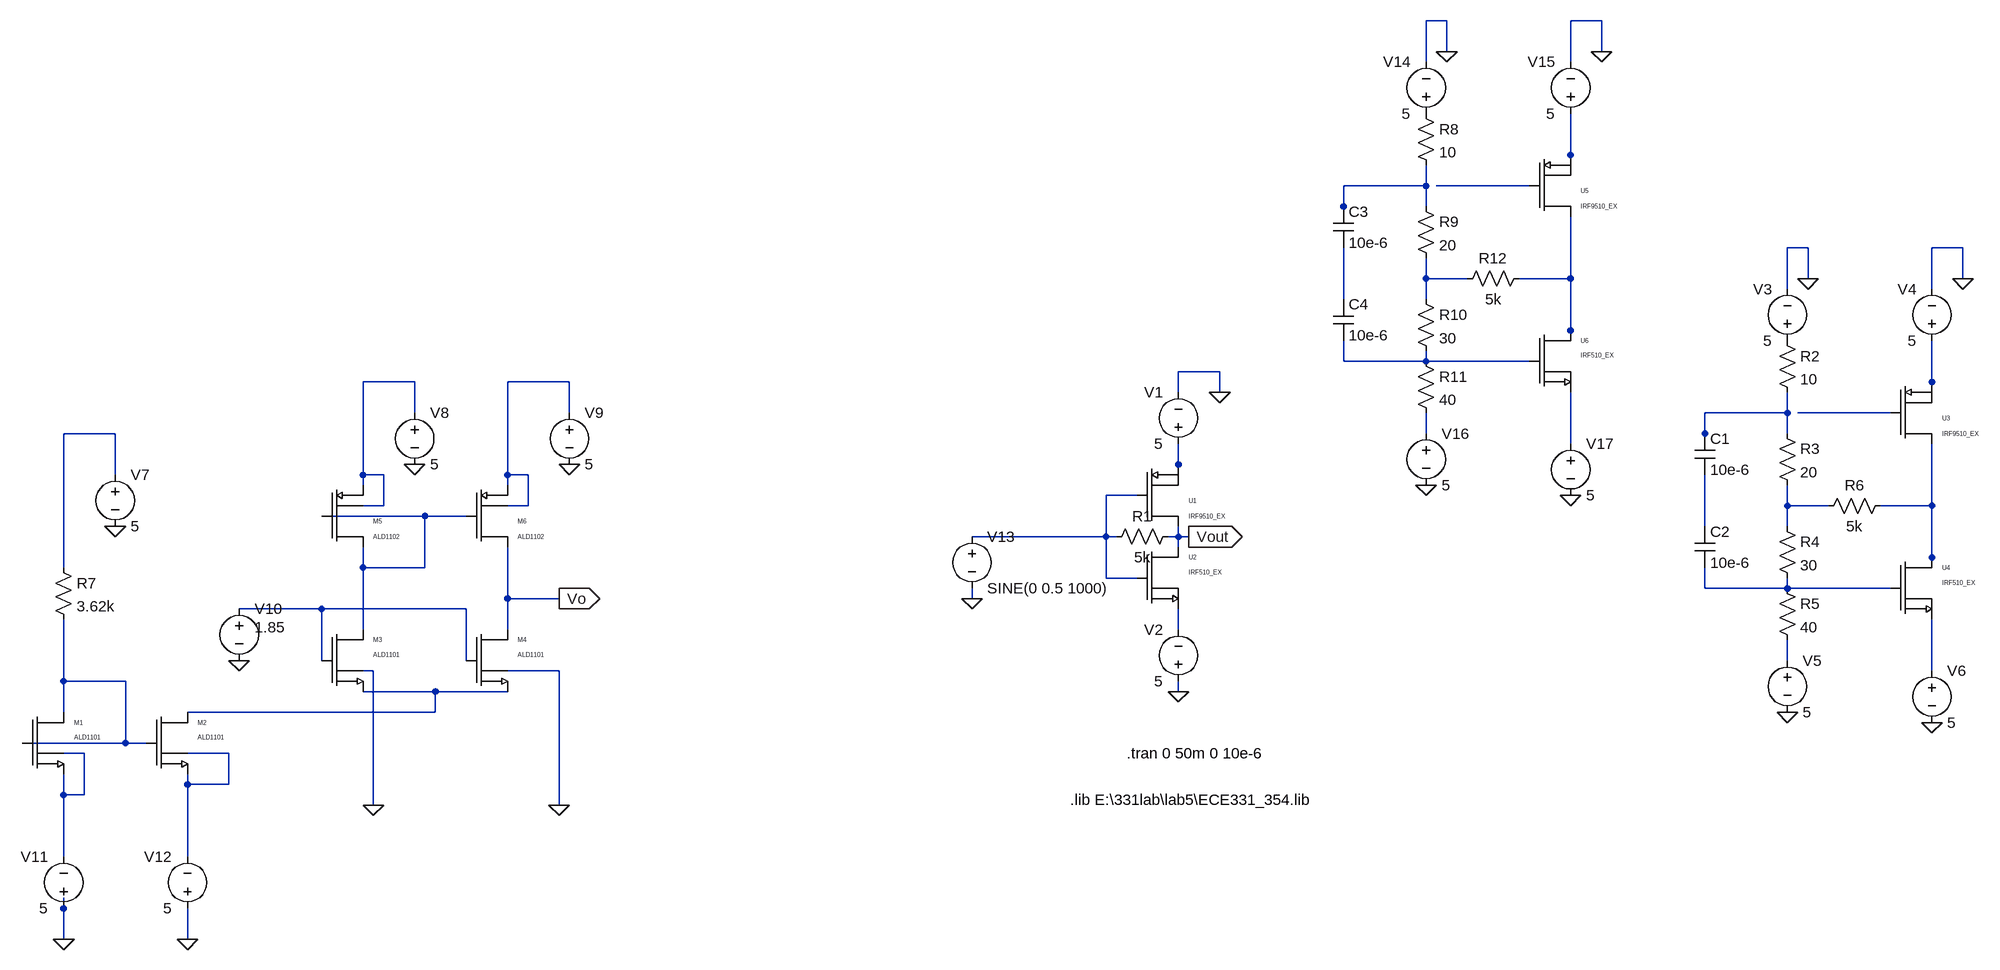
[diagram p0: schematic lab5_x.asc]
lab5_x.asc, the LTspice schematic file:
Version 4
SHEET 1 1404 932
WIRE 480 -512 448 -512
WIRE 720 -512 672 -512
WIRE 480 -464 480 -512
WIRE 720 -464 720 -512
WIRE 448 -448 448 -512
WIRE 672 -448 672 -512
WIRE 672 -304 672 -368
WIRE 672 -288 672 -304
WIRE 448 -256 448 -288
WIRE 448 -256 320 -256
WIRE 608 -256 464 -256
WIRE 320 -224 320 -256
WIRE 448 -224 448 -256
WIRE 320 -208 320 -224
WIRE 1040 -160 1008 -160
WIRE 1280 -160 1232 -160
WIRE 448 -112 448 -144
WIRE 512 -112 448 -112
WIRE 672 -112 672 -208
WIRE 672 -112 592 -112
WIRE 1040 -112 1040 -160
WIRE 1280 -112 1280 -160
WIRE 1008 -96 1008 -160
WIRE 1232 -96 1232 -160
WIRE 320 -80 320 -160
WIRE 448 -80 448 -112
WIRE 672 -32 672 -112
WIRE 672 -16 672 -32
WIRE 320 16 320 -16
WIRE 448 16 448 0
WIRE 448 16 320 16
WIRE 608 16 448 16
WIRE 128 32 64 32
WIRE -1120 48 -1200 48
WIRE -880 48 -976 48
WIRE 1232 48 1232 -16
WIRE 64 64 64 32
WIRE 128 64 128 32
WIRE 1232 64 1232 48
WIRE -1120 96 -1120 48
WIRE -880 96 -880 48
WIRE 1008 96 1008 64
WIRE 1008 96 880 96
WIRE 1168 96 1024 96
WIRE -1584 128 -1664 128
WIRE 448 128 448 96
WIRE 880 128 880 96
WIRE 1008 128 1008 96
WIRE 672 144 672 64
WIRE 880 144 880 128
WIRE 64 176 64 144
WIRE -1584 192 -1584 128
WIRE -1200 192 -1200 48
WIRE -1168 192 -1200 192
WIRE -976 192 -976 48
WIRE -944 192 -976 192
WIRE 64 192 64 176
WIRE -1200 208 -1200 192
WIRE -976 208 -976 192
WIRE 0 224 -48 224
WIRE -1168 240 -1168 192
WIRE -1168 240 -1200 240
WIRE -944 240 -944 192
WIRE -944 240 -976 240
WIRE 1008 240 1008 208
WIRE 1072 240 1008 240
WIRE 1232 240 1232 144
WIRE 1232 240 1152 240
WIRE -1104 256 -1264 256
WIRE -1040 256 -1104 256
WIRE 880 272 880 192
WIRE 1008 272 1008 240
WIRE -48 288 -48 224
WIRE -48 288 -256 288
WIRE -32 288 -48 288
WIRE 64 288 64 272
WIRE 64 288 48 288
WIRE 80 288 64 288
WIRE 64 304 64 288
WIRE 1232 320 1232 240
WIRE -1664 336 -1664 128
WIRE -1200 336 -1200 304
WIRE -1104 336 -1104 256
WIRE -1104 336 -1200 336
WIRE 1232 336 1232 320
WIRE -48 352 -48 288
WIRE 0 352 -48 352
WIRE 880 368 880 336
WIRE 1008 368 1008 352
WIRE 1008 368 880 368
WIRE 1168 368 1008 368
WIRE -976 384 -976 304
WIRE -896 384 -976 384
WIRE -256 384 -256 368
WIRE -1264 400 -1392 400
WIRE -1040 400 -1264 400
WIRE -1200 432 -1200 336
WIRE -976 432 -976 384
WIRE 64 432 64 400
WIRE -1264 480 -1264 400
WIRE -1040 480 -1040 400
WIRE 1008 480 1008 448
WIRE -1184 496 -1200 496
WIRE -896 496 -976 496
WIRE 1232 496 1232 416
WIRE -1664 512 -1664 416
WIRE -1568 512 -1664 512
WIRE -1088 528 -1200 528
WIRE -976 528 -1088 528
WIRE 64 528 64 512
WIRE -1664 560 -1664 512
WIRE -1088 560 -1088 528
WIRE -1088 560 -1472 560
WIRE -1568 608 -1568 512
WIRE -1568 608 -1728 608
WIRE -1536 608 -1568 608
WIRE -1632 624 -1664 624
WIRE -1408 624 -1472 624
WIRE -1472 672 -1472 656
WIRE -1408 672 -1408 624
WIRE -1408 672 -1472 672
WIRE -1664 688 -1664 656
WIRE -1632 688 -1632 624
WIRE -1632 688 -1664 688
WIRE -1184 704 -1184 496
WIRE -896 704 -896 496
WIRE -1664 784 -1664 688
WIRE -1472 784 -1472 672
WIRE -1664 864 -1664 848
WIRE -1664 912 -1664 864
WIRE -1472 912 -1472 864
FLAG 128 64 0
FLAG 64 528 0
FLAG 80 288 Vout
IOPIN 80 288 Out
FLAG 1008 560 0
FLAG 1232 576 0
FLAG 1040 -112 0
FLAG 1280 -112 0
FLAG -1184 704 0
FLAG -896 704 0
FLAG -896 384 Vo
IOPIN -896 384 Out
FLAG -1120 176 0
FLAG -880 176 0
FLAG -1584 272 0
FLAG -1392 480 0
FLAG -1664 912 0
FLAG -1472 912 0
FLAG -256 384 0
FLAG 448 208 0
FLAG 672 224 0
FLAG 480 -464 0
FLAG 720 -464 0
SYMBOL voltage 64 160 R180
WINDOW 0 24 96 Left 2
WINDOW 3 24 16 Left 2
WINDOW 123 0 0 Left 2
WINDOW 39 0 0 Left 2
SYMATTR InstName V1
SYMATTR Value 5
SYMBOL IRF9510 0 176 R0
SYMATTR InstName U1
SYMBOL IRF510 0 304 R0
SYMATTR InstName U2
SYMBOL res 64 272 R90
WINDOW 0 0 56 VBottom 2
WINDOW 3 32 56 VTop 2
SYMATTR InstName R1
SYMATTR Value 5k
SYMBOL voltage 64 528 R180
WINDOW 0 24 96 Left 2
WINDOW 3 24 16 Left 2
WINDOW 123 0 0 Left 2
WINDOW 39 0 0 Left 2
SYMATTR InstName V2
SYMATTR Value 5
SYMBOL voltage 1008 0 R180
WINDOW 0 24 96 Left 2
WINDOW 3 24 16 Left 2
WINDOW 123 0 0 Left 2
WINDOW 39 0 0 Left 2
SYMATTR InstName V3
SYMATTR Value 5
SYMBOL voltage 1232 0 R180
WINDOW 0 24 96 Left 2
WINDOW 3 24 16 Left 2
WINDOW 123 0 0 Left 2
WINDOW 39 0 0 Left 2
SYMATTR InstName V4
SYMATTR Value 5
SYMBOL voltage 1008 464 R0
WINDOW 123 0 0 Left 2
WINDOW 39 0 0 Left 2
SYMATTR InstName V5
SYMATTR Value 5
SYMBOL voltage 1232 480 R0
WINDOW 123 0 0 Left 2
WINDOW 39 0 0 Left 2
SYMATTR InstName V6
SYMATTR Value 5
SYMBOL res 992 -32 R0
SYMATTR InstName R2
SYMATTR Value 10
SYMBOL res 992 112 R0
SYMATTR InstName R3
SYMATTR Value 20
SYMBOL res 992 256 R0
SYMATTR InstName R4
SYMATTR Value 30
SYMBOL res 992 352 R0
SYMATTR InstName R5
SYMATTR Value 40
SYMBOL cap 864 128 R0
SYMATTR InstName C1
SYMATTR Value 10e-6
SYMATTR SpiceLine V=4 Irms=8.88 Rser=0.00522854 Lser=0
SYMBOL cap 864 272 R0
SYMATTR InstName C2
SYMATTR Value 10e-6
SYMBOL res 1168 224 R90
WINDOW 0 0 56 VBottom 2
WINDOW 3 32 56 VTop 2
SYMATTR InstName R6
SYMATTR Value 5k
SYMBOL IRF9510 1168 48 R0
SYMATTR InstName U3
SYMBOL IRF510 1168 320 R0
SYMATTR InstName U4
SYMBOL ALD1101 -1728 560 R0
SYMATTR InstName M1
SYMBOL ALD1101 -1536 560 R0
SYMATTR InstName M2
SYMBOL ALD1101 -1264 432 R0
SYMATTR InstName M3
SYMBOL ALD1101 -1040 432 R0
SYMATTR InstName M4
SYMBOL ALD1102 -1264 208 R0
SYMATTR InstName M5
SYMBOL ALD1102 -1040 208 R0
SYMATTR InstName M6
SYMBOL voltage -1584 176 R0
WINDOW 123 0 0 Left 2
WINDOW 39 0 0 Left 2
SYMATTR InstName V7
SYMATTR Value 5
SYMBOL voltage -1120 80 R0
WINDOW 123 0 0 Left 2
WINDOW 39 0 0 Left 2
SYMATTR InstName V8
SYMATTR Value 5
SYMBOL voltage -880 80 R0
WINDOW 123 0 0 Left 2
WINDOW 39 0 0 Left 2
SYMATTR InstName V9
SYMATTR Value 5
SYMBOL res -1680 320 R0
SYMATTR InstName R7
SYMATTR Value 3.62k
SYMBOL voltage -1392 384 R0
WINDOW 3 24 44 Left 2
WINDOW 123 24 72 Left 2
WINDOW 39 0 0 Left 2
SYMATTR Value 1.85
SYMATTR InstName V10
SYMBOL voltage -1664 880 R180
WINDOW 0 24 96 Left 2
WINDOW 3 24 16 Left 2
WINDOW 123 0 0 Left 2
WINDOW 39 0 0 Left 2
SYMATTR InstName V11
SYMATTR Value 5
SYMBOL voltage -1472 880 R180
WINDOW 0 24 96 Left 2
WINDOW 3 24 16 Left 2
WINDOW 123 0 0 Left 2
WINDOW 39 0 0 Left 2
SYMATTR InstName V12
SYMATTR Value 5
SYMBOL voltage -256 272 R0
WINDOW 123 0 0 Left 2
WINDOW 39 0 0 Left 2
SYMATTR InstName V13
SYMATTR Value SINE(0 0.5 1000)
SYMBOL voltage 448 -352 R180
WINDOW 0 24 96 Left 2
WINDOW 3 24 16 Left 2
WINDOW 123 0 0 Left 2
WINDOW 39 0 0 Left 2
SYMATTR InstName V14
SYMATTR Value 5
SYMBOL voltage 672 -352 R180
WINDOW 0 24 96 Left 2
WINDOW 3 24 16 Left 2
WINDOW 123 0 0 Left 2
WINDOW 39 0 0 Left 2
SYMATTR InstName V15
SYMATTR Value 5
SYMBOL voltage 448 112 R0
WINDOW 123 0 0 Left 2
WINDOW 39 0 0 Left 2
SYMATTR InstName V16
SYMATTR Value 5
SYMBOL voltage 672 128 R0
WINDOW 123 0 0 Left 2
WINDOW 39 0 0 Left 2
SYMATTR InstName V17
SYMATTR Value 5
SYMBOL res 432 -384 R0
SYMATTR InstName R8
SYMATTR Value 10
SYMBOL res 432 -240 R0
SYMATTR InstName R9
SYMATTR Value 20
SYMBOL res 432 -96 R0
SYMATTR InstName R10
SYMATTR Value 30
SYMBOL res 432 0 R0
SYMATTR InstName R11
SYMATTR Value 40
SYMBOL cap 304 -224 R0
SYMATTR InstName C3
SYMATTR Value 10e-6
SYMATTR SpiceLine V=4 Irms=8.88 Rser=0.00522854 Lser=0
SYMBOL cap 304 -80 R0
SYMATTR InstName C4
SYMATTR Value 10e-6
SYMBOL res 608 -128 R90
WINDOW 0 0 56 VBottom 2
WINDOW 3 32 56 VTop 2
SYMATTR InstName R12
SYMATTR Value 5k
SYMBOL IRF9510 608 -304 R0
SYMATTR InstName U5
SYMBOL IRF510 608 -32 R0
SYMATTR InstName U6
TEXT -16 624 Left 2 !.tran 0 50m 0 10e-6
TEXT -104 696 Left 2 !.lib E:\\331lab\\lab5\\ECE331_354.lib

The netlist it stands for:
* lab5_x.asc
V1 N016 0 5
XU1 Vout N017 N016 IRF9510_EX  ; pins D G S
XU2 Vout N017 N024 IRF510_EX  ; pins D G S
R1 Vout N017 5k
V2 0 N024 5
V3 P001 0 5
V4 N010 0 5
V5 N025 0 5
V6 N026 0 5
R2 P001 N011 10
R3 N011 N018 20
R4 N018 N022 30
R5 N022 N025 40
C1 N011 N021 10e-6 V=4 Irms=8.88 Rser=0.00522854 Lser=0
C2 N021 N022 10e-6
R6 N019 N018 5k
XU3 N019 N012 N010 IRF9510_EX  ; pins D G S
XU4 N019 N022 N026 IRF510_EX  ; pins D G S
M1 N027 N027 N029 N029 ALD1101 W=1.379e-3 L=1E-6
M2 N028 N027 N030 N030 ALD1101 W=1.379e-3 L=1E-6
M3 N020 N023 N028 0 ALD1101 W=1.379e-3 L=1E-6
M4 Vo N023 N028 0 ALD1101 W=1.379e-3 L=1E-6
M5 N020 N020 N008 N008 ALD1102 W=1.739e-3 L=1e-6
M6 Vo N020 N009 N009 ALD1102 W=1.739e-3 L=1e-6
V7 N013 0 5
V8 N008 0 5
V9 N009 0 5
R7 N013 N027 3.62k
V10 N023 0 1.85
V11 0 N029 5
V12 0 N030 5
V13 N017 0 SINE(0 0.5 1000)
V14 P002 0 5
V15 N001 0 5
V16 N014 0 5
V17 N015 0 5
R8 P002 N002 10
R9 N002 N004 20
R10 N004 N007 30
R11 N007 N014 40
C3 N002 N006 10e-6 V=4 Irms=8.88 Rser=0.00522854 Lser=0
C4 N006 N007 10e-6
R12 N005 N004 5k
XU5 N005 N003 N001 IRF9510_EX  ; pins D G S
XU6 N005 N007 N015 IRF510_EX  ; pins D G S
.model NMOS NMOS
.model PMOS PMOS
.lib standard.mos
.tran 0 50m 0 10e-6
.lib E:\331lab\lab5\ECE331_354.lib
.backanno
.end